# Altium project AIL_TSAL.PrjPcb
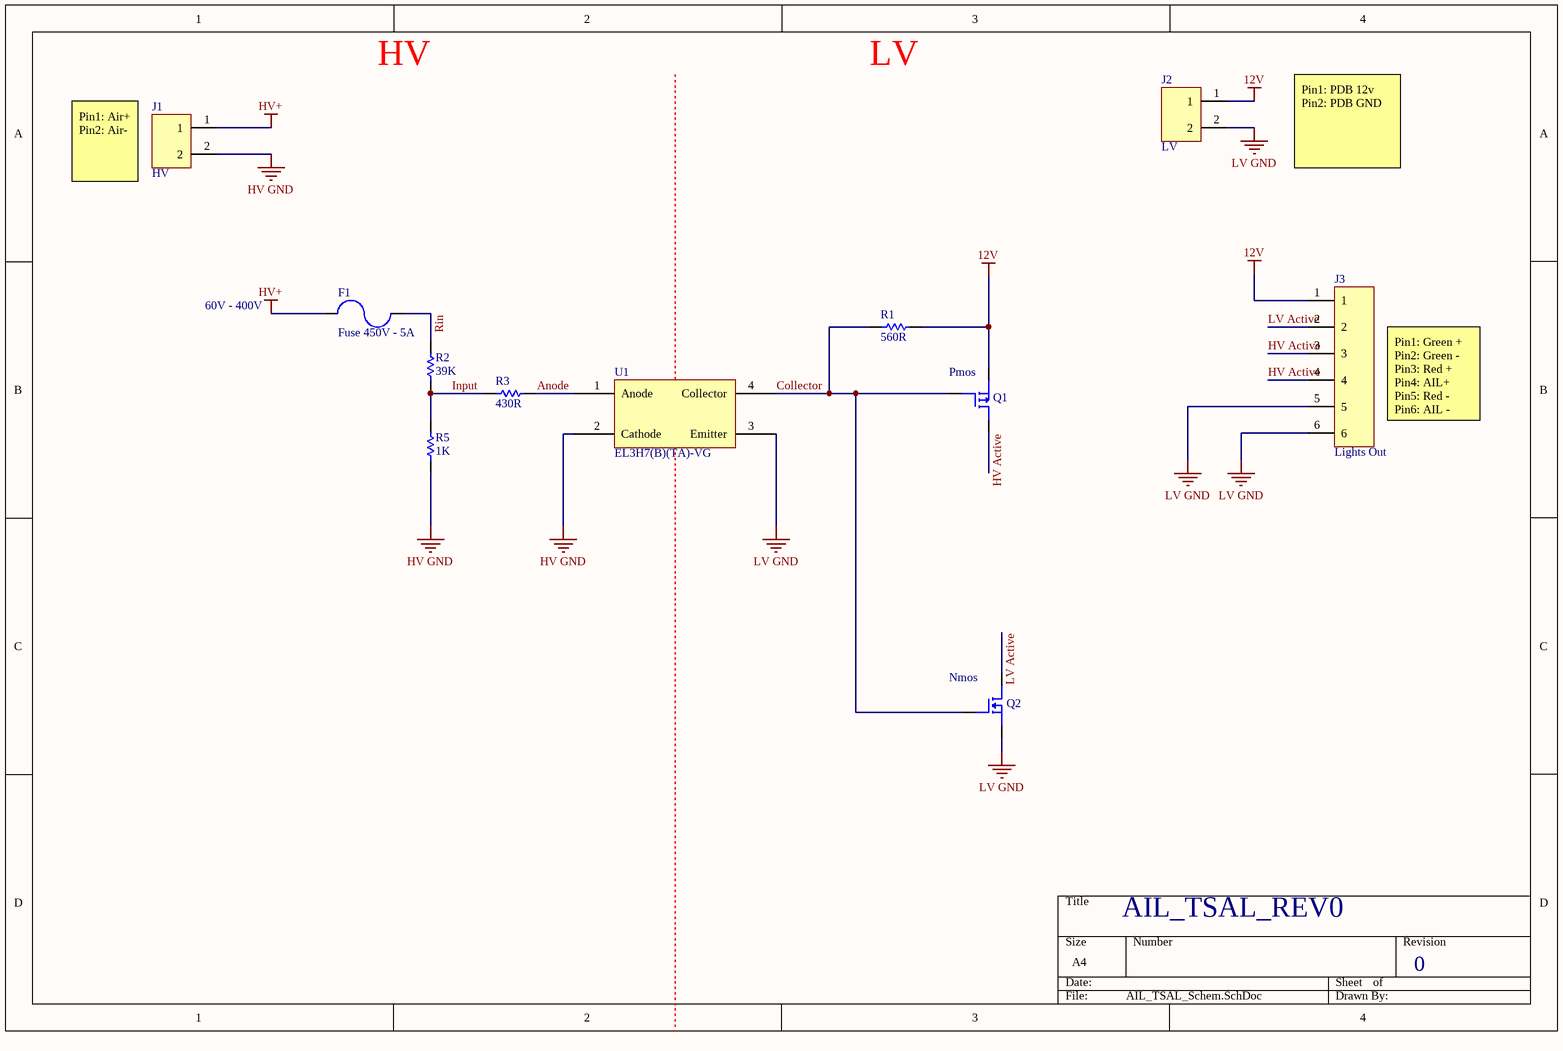
[diagram p0: AIL_TSAL_Schem.SchDoc]
1 sheet, 11 parts. Net scope: global (net labels, ports and power ports of the same name join across sheets).
Board file: AIL_TSAL_PCB.PcbDoc

## Sheet AIL_TSAL_Schem.SchDoc
size A4; SheetNumber: 1; SheetTotal: 1

### Parts
F1  Fuse 450V - 5A  [Fuse-11.2x5.05]
J1  HV  [2PIN]
J2  LV  [2PIN]
J3  Lights Out  [6PIN]
Q1  NTD2955T4GOSCT-ND  [DPAK-TO252]  (value not drawn)
Q2  IPD50N06S4L12ATMA2CT-ND  [DPAK-TO252]  (value not drawn)
R1  560R  [RES-0603]
R2  39K  [RES-0603]
R3  430R  [RES-0603]
R5  1K  [RES-0603]
U1  EL3H7(B)(TA)-VG  [SOIC127P700X200-4N]

### Nets
12V: J2.1 J3.1 Q1.3 R1.2
HV GND: J1.2 R5.1 U1.2(Cathode)
HV+: F1.1 J1.1
LV GND: J2.2 J3.5 J3.6 Q2.3 U1.3(Emitter)
Anode: R3.2 U1.1(Anode)
Collector: Q1.1 Q2.1 R1.1 U1.4(Collector)
HV Active: J3.3 J3.4 Q1.2
Input: R2.1 R3.1 R5.2
LV Active: J3.2 Q2.2
Rin: F1.2 R2.2

### Notes on the sheet
- HV
- LV
- (near J1) Pin1: Air+
  Pin2: Air-
- Pin1: PDB 12v
  Pin2: PDB GND
- 60V - 400V
- (near Q1) Pmos
- (near J3) Pin1: Green +
  Pin2: Green -
  Pin3: Red +
  Pin4: AIL+
  Pin5: Red -
  Pin6: AIL -
- (near Q2) Nmos
- AIL_TSAL_REV0
- 0

### Library data of the parts
F1 = Fuse 450V - 5A: FUSE 500VDC 350VAC SMT 5A; Supplier 1: DigiKey
J1 J2 = 2PIN: CONN HEADER R/A 2POS 2.54MM; Manufacturer: Molex; Manufacturer Part Number: 0705530106; Number of Positions: 2; Contact Resistance: 30mR; Connector Type: Male Pin; Supplier 1: Digi-Key; Stock 1: 2224; Pricing 1: 1=1.38, 10=1.25, 100=1.071, 500=0.8925, 1000=0.765, 5000=0.6783, 10000=0.663 (USD); Mount: Through Hole; Housing Material: Polyester; Contact Plating: Gold; Contact Material: Bronze; Color: Black; Housing Color: Black; Min Operating Temperature: -40°C; Max Operating Temperature: 105°C; Number of Rows: 1; Packaging: Rail/Tube; Termination: Solder; Number of Contacts: 2; Orientation: Right Angle; Length: 7.37mm; Pitch: 2.54mm; Depth: 13.59mm; Contact Mating Length: 0.24inch; ComponentLink1URL: http://www.molex.com/webdocs/datasheets/pdf/en-us/0705530106_PCB_HEADERS.pdf?src-supplier=Avnet+Asia; ComponentLink1Description: http://www.molex.com/webdocs/datasheets/pdf/en-us/0705530106_PCB_HEADERS.pdf?src-supplier=Avnet+Asia; ComponentLink2URL: https://www.molex.com/pdm_docs/ps/PS-70400.pdf?src-supplier=Digi-Key; ComponentLink2Description: https://www.molex.com/pdm_docs/ps/PS-70400.pdf?src-supplier=Digi-Key; Supplier Part Number 1: WM4153-ND
J3 = 6PIN: CONN HEADER R/A 6POS 2.54MM; Manufacturer: Molex; Manufacturer Part Number: 70553-0040; Contact Resistance: 30mR; Number of Positions: 6; Current Rating: 3A; Voltage Rating: 250V; Gender: Male; Insulation Resistance: 1GR; Glow Wire Compliant: Non-compliant; Supplier 1: Digi-Key; Stock 1: 2212; Pricing 1: 1=1.58, 10=1.434, 100=1.2289, 500=1.0241, 1000=0.8778, 5000=0.77832, 10000=0.76076 (USD); Mount: Through Hole; Contact Material: Bronze,Copper Alloy,Brass; Contact Plating: Tin; Housing Color: Black; Color: Black; Housing Material: Thermoplastic; Material: Brass; Min Operating Temperature: -40°C; Max Operating Temperature: 105°C; Number of Rows: 1; Packaging: Rail/Tube; Termination: Solder; Number of Contacts: 6; Orientation: Right Angle; Package Quantity: 1200; Max Current Rating: 3A; Max Voltage Rating (AC): 250V; Voltage Rating (DC): 250V; Number of Circuits: 6; Length: 17.79mm; Height: 6.99mm; Pitch: 2.54mm; Depth: 13.59mm; Radiation Hardening: No; REACH SVHC: Unknown; ELV: Compliant; Lead Free: Lead Free; Flammability Rating: UL94 V-0; ComponentLink1URL: http://uk.rs-online.com/webdocs/13c4/0900766b813c4993.pdf?src-supplier=RSComponents; ComponentLink1Description: http://uk.rs-online.com/webdocs/13c4/0900766b813c4993.pdf?src-supplier=RSComponents; ComponentLink2URL: http://www.molex.com/webdocs/datasheets/pdf/en-us/0705530040_PCB_HEADERS.pdf?src-supplier=Avnet+Europe; ComponentLink2Description: http://www.molex.com/webdocs/datasheets/pdf/en-us/0705530040_PCB_HEADERS.pdf?src-supplier=Avnet+Europe; ComponentLink3URL: http://www.farnell.com/datasheets/1844551.pdf?src-supplier=Farnell; ComponentLink3Description: http://www.farnell.com/datasheets/1844551.pdf?src-supplier=Farnell; ComponentLink4URL: http://www.mouser.com/ds/2/276/0705530040_PCB_HEADERS-172948.pdf?src-supplier=Mouser; ComponentLink4Description: http://www.mouser.com/ds/2/276/0705530040_PCB_HEADERS-172948.pdf?src-supplier=Mouser; ComponentLink5URL: http://www.farnell.com/cad/655744.pdf?src-supplier=Element14; ComponentLink5Description: http://www.farnell.com/cad/655744.pdf?src-supplier=Element14; ComponentLink6URL: http://www.jameco.com/Jameco/Products/ProdDS/1302975.pdf?src-supplier=Jameco; ComponentLink6Description: http://www.jameco.com/Jameco/Products/ProdDS/1302975.pdf?src-supplier=Jameco; Supplier Part Number 1: WM4928-ND
Q1 = P-FET-60V-12A: MOSFET P-CH 60V 12A DPAK; Manufacturer: ON Semiconductor; Rise Time: 45ns; Nominal Vgs: -2.8V; Input Capacitance: 750pF; Max Power Dissipation: 55W; Number of Elements: 1; Rds On Max: 180mR; Fall Time: 48ns; Drain to Source Resistance: 155mR; Turn-Off Delay Time: 26ns; Drain to Source Voltage (Vdss): -60V; Turn-On Delay Time: 10ns; Element Configuration: Single; Gate to Source Voltage (Vgs): 20V; Current Rating: -12A; Supplier 1: Digi-Key; Manufacturer Part Number: NTD2955T4G; Stock 1: 9993; Pricing 1: 1=0.76, 10=0.672, 25=0.6316, 100=0.4583, 250=0.44204, 500=0.38296, 1000=0.32592 (USD); Case/Package: DPAK; Number of Pins: 3; Contact Plating: Tin,Matte; Min Operating Temperature: -55°C; Max Operating Temperature: 175°C; Package Quantity: 1; Packaging: Tape and Reel; Power Dissipation: 55W; Continuous Drain Current (ID): 12A; Threshold Voltage: -2.8V; Drain to Source Breakdown Voltage: -60V; Voltage Rating (DC): -60V; On-State Resistance: 180mR; Number of Channels: 1; Length: 6.73mm; Height: 2.38mm; Width: 6.22mm; Radiation Hardening: No; REACH SVHC: No SVHC; Lead Free: Lead Free; ComponentLink1URL: http://www.onsemi.com/pub/Collateral/NTD2955-D.PDF?src-supplier=Avnet; ComponentLink1Description: http://www.onsemi.com/pub/Collateral/NTD2955-D.PDF?src-supplier=Avnet; ComponentLink2URL: http://www.onsemi.com/pub/Collateral/NTD2955-D.PDF?src-supplier=Avnet+Europe; ComponentLink2Description: http://www.onsemi.com/pub/Collateral/NTD2955-D.PDF?src-supplier=Avnet+Europe; ComponentLink3URL: http://www.onsemi.com/pub_link/Collateral/NTD2955-D.PDF?src-supplier=Element14; ComponentLink3Description: http://www.onsemi.com/pub_link/Collateral/NTD2955-D.PDF?src-supplier=Element14; ComponentLink4URL: http://www.onsemi.com/pub/Collateral/NTD2955-D.PDF?src-supplier=Digi-Key; ComponentLink4Description: http://www.onsemi.com/pub/Collateral/NTD2955-D.PDF?src-supplier=Digi-Key; ComponentLink5URL: http://www.jameco.com/Jameco/Products/ProdDS/1178118.pdf?src-supplier=Jameco; ComponentLink5Description: http://www.jameco.com/Jameco/Products/ProdDS/1178118.pdf?src-supplier=Jameco; Supplier Part Number 1: NTD2955T4GOSDKR-ND
Q2 = N-FET-60V-50A: MOSFET N-CH 60V 50A TO252-3; Manufacturer: Infineon; Rise Time: 2ns; Rds On Max: 12mR; Input Capacitance: 2.89nF; Max Power Dissipation: 50W; Turn-On Delay Time: 6ns; Turn-Off Delay Time: 25ns; Fall Time: 5ns; Gate to Source Voltage (Vgs): 16V; Manufacturer Part Number: IPD50N06S4L12ATMA2; Stock 1: 3187; Pricing 1: 1=0.92, 10=0.806, 25=0.7572, 100=0.5497, 250=0.53012, 500=0.45928, 1000=0.39088 (USD); Mount: Surface Mount; Case/Package: TO-252-3; Number of Pins: 3; Min Operating Temperature: -55°C; Max Operating Temperature: 175°C; Packaging: Tape and Reel; Drain to Source Voltage (Vdss): 60V; Continuous Drain Current (ID): 50A; Max Dual Supply Voltage: 60V; Supplier Part Number 1: IPD50N06S4L12ATMA2DKR-ND; Supplier 1: Digi-Key
R1 = 0603 - 560R: RES 560 OHM 1% 1/10W 0603; Supplier 1: Digi-Key
R2 = 0603-39KR: RES SMD 39K OHM 1% 1/10W; Manufacturer: TE Connectivity; Manufacturer Part Number: CRGCQ0603F39K; Resistance: 39kR; Max Power Dissipation: 100mW; Temperature Coefficient: 100ppm/°C; Supplier 1: Digi-Key; Stock 1: 57588; Pricing 1: 1=0.1, 10=0.03, 100=0.012, 1000=0.00541, 2500=0.00469 (USD); Case/Package: 0603; Case Code (Imperial): 0603; Case Code (Metric): 1608; Min Operating Temperature: -55°C; Max Operating Temperature: 155°C; Composition: Thick Film; Features: Moisture Resistant,Automotive AEC-Q200; Packaging: Tape and Reel; Tolerance: 1%; Number of Terminations: 2; ComponentLink1URL: https://4donline.ihs.com/images/VipMasterIC/IC/TYEL/TYEL-S-A0004929575/TYEL-S-A0004929575-1.pdf?hkey=52A5661711E402568146F3353EA87419&src-supplier=Newark; ComponentLink1Description: https://4donline.ihs.com/images/VipMasterIC/IC/TYEL/TYEL-S-A0004929575/TYEL-S-A0004929575-1.pdf?hkey=52A5661711E402568146F3353EA87419&src-supplier=Newark; ComponentLink2URL: https://4donline.ihs.com/images/VipMasterIC/IC/TYEL/TYEL-S-A0004929575/TYEL-S-A0004929575-1.pdf?hkey=52A5661711E402568146F3353EA87419&src-supplier=Farnell; ComponentLink2Description: https://4donline.ihs.com/images/VipMasterIC/IC/TYEL/TYEL-S-A0004929575/TYEL-S-A0004929575-1.pdf?hkey=52A5661711E402568146F3353EA87419&src-supplier=Farnell; ComponentLink3URL: https://www.te.com/commerce/DocumentDelivery/DDEController?Action=srchrtrv&DocNm=1773204-3&DocType=DS&DocLang=English&src-supplier=Digi-Key; ComponentLink3Description: https://www.te.com/commerce/DocumentDelivery/DDEController?Action=srchrtrv&DocNm=1773204-3&DocType=DS&DocLang=English&src-supplier=Digi-Key; ComponentLink4URL: https://www.te.com/commerce/DocumentDelivery/DDEController?Action=srchrtrv&amp;DocNm=1773204-3&amp;DocType=DS&amp;DocLang=English&src-supplier=Digi-Key; ComponentLink4Description: https://www.te.com/commerce/DocumentDelivery/DDEController?Action=srchrtrv&amp;DocNm=1773204-3&amp;DocType=DS&amp;DocLang=English&src-supplier=Digi-Key; Supplier Part Number 1: A129707DKR-ND
R3 = 0603 - 430R: RES 430 OHM 1% 1/10W 0603; Supplier 1: Digi-Key
R5 = 0603-1KR: RES SMD 1K OHM 1% 1/10W 0603; Manufacturer: Vishay Dale; Manufacturer Part Number: CRCW06031K00FKEA; Resistance: 1kR; Power Rating: 100mW; Voltage Rating: 75V; Temperature Coefficient: 100ppm/°C; Supplier 1: Digi-Key; Stock 1: 671453; Pricing 1: 1=0.1, 10=0.034, 100=0.0139, 1000=0.00623, 2500=0.0054 (USD); Mount: Surface Mount; Case/Package: 0603; Number of Pins: 2; Weight: 7.1E-05oz; Case Code (Metric): 1608; Case Code (Imperial): 0603; Contact Plating: Tin; Min Operating Temperature: -55°C; Max Operating Temperature: 155°C; Composition: Thick Film; Tolerance: 1%; Packaging: Tape and Reel; Package Quantity: 10; Number of Terminations: 2; Termination: SMD/SMT; Military Standard: Not; Max Power Dissipation: 100mW; Voltage Rating (DC): 75V; Features: Automotive AEC-Q200; Length: 1.55mm; Height: 0.45mm; Width: 0.033inch; Depth: 0.85mm; Radiation Hardening: No; REACH SVHC: Unknown; Lead Free: Lead Free; ComponentLink1URL: http://www.vishay.com/docs/20035/dcrcwe3.pdf?src-supplier=Digi-Key; ComponentLink1Description: http://www.vishay.com/docs/20035/dcrcwe3.pdf?src-supplier=Digi-Key; ComponentLink2URL: http://uk.rs-online.com/webdocs/0d98/0900766b80d98afc.pdf?src-supplier=RSComponents; ComponentLink2Description: http://uk.rs-online.com/webdocs/0d98/0900766b80d98afc.pdf?src-supplier=RSComponents; ComponentLink3URL: http://www.vishay.com/docs/20035/dcrcwe3.pdf?src-supplier=Avnet; ComponentLink3Description: http://www.vishay.com/docs/20035/dcrcwe3.pdf?src-supplier=Avnet; ComponentLink4URL: http://www.vishay.com/docs/20035/dcrcwe3.pdf?src-supplier=Avnet+Asia; ComponentLink4Description: http://www.vishay.com/docs/20035/dcrcwe3.pdf?src-supplier=Avnet+Asia; ComponentLink5URL: http://www.farnell.com/datasheets/2310790.pdf?src-supplier=Element14; ComponentLink5Description: http://www.farnell.com/datasheets/2310790.pdf?src-supplier=Element14; ComponentLink6URL: https://www.distrelec.biz/Web/Downloads/a_/en/flD-CRCW-e3_data_en.pdf?mime=application%2Fpdf&src-supplier=Distrelec; ComponentLink6Description: https://www.distrelec.biz/Web/Downloads/a_/en/flD-CRCW-e3_data_en.pdf?mime=application%2Fpdf&src-supplier=Distrelec; ComponentLink7URL: http://www.vishay.com/docs/20035/dcrcwe3.pdf?src-supplier=Future+Electronics; ComponentLink7Description: http://www.vishay.com/docs/20035/dcrcwe3.pdf?src-supplier=Future+Electronics; ComponentLink8URL: http://www.vishay.com/docs/20035/dcrcwe3.pdf?src-supplier=Avnet+Europe; ComponentLink8Description: http://www.vishay.com/docs/20035/dcrcwe3.pdf?src-supplier=Avnet+Europe; Supplier Part Number 1: 541-1.00KHCT-ND
U1 = EL3H7(B)(TA)-VG: OPTOISOLATOR 3.75KV TRANS 4-SSOP; Manufacturer: Everlight; Number of Channels: 1; Collector Emitter Voltage (VCEO): 80V; Max Power Dissipation: 200mW; Forward Current: 50mA; Forward Voltage: 1.4V; Reverse Breakdown Voltage: 6V; Rise Time: 18000ns; Collector Emitter Saturation Voltage: 200mV; Current Transfer Ratio: 260%; Approvals: UL; Supplier 1: Digi-Key; Manufacturer Part Number: EL3H7(B)(TA)-VG; Stock 1: 119652; Pricing 1: 1=0.42, 10=0.304, 25=0.248, 100=0.1985, 250=0.16752, 500=0.1427, 1000=0.11167, 2500=0.10237 (USD); Mount: Surface Mount; Case/Package: SSOP; Number of Pins: 4; Min Operating Temperature: -55°C; Max Operating Temperature: 125°C; Packaging: Tape and Reel; Package Quantity: 1; Max Output Voltage: 80V; Output Current per Channel: 50mA; Max Input Current: 50mA; Max Collector Current: 50mA; Fall Time: 18000ns; Isolation Voltage: 3.75kV; Number of Elements: 1; Power Dissipation: 200mW; Collector Emitter Breakdown Voltage: 80V; Radiation Hardening: No; Lead Free: Lead Free; ComponentLink1URL: https://everlightamericas.com/index.php?controller=attachment&id_attachment=2584&src-supplier=Digi-Key; ComponentLink1Description: https://everlightamericas.com/index.php?controller=attachment&id_attachment=2584&src-supplier=Digi-Key; ComponentLink2URL: https://everlightamericas.com/index.php?controller=attachment&amp;id_attachment=2584&src-supplier=Digi-Key; ComponentLink2Description: https://everlightamericas.com/index.php?controller=attachment&amp;id_attachment=2584&src-supplier=Digi-Key; ComponentLink3URL: https://www.verical.com/server-webapp/html/getDatasheet?partID=416716&src-supplier=Verical; ComponentLink3Description: https://www.verical.com/server-webapp/html/getDatasheet?partID=416716&src-supplier=Verical; Supplier Part Number 1: 1080-1197-6-ND